# EAGLE schematic final version (1) (EAGLE 8.2.2)
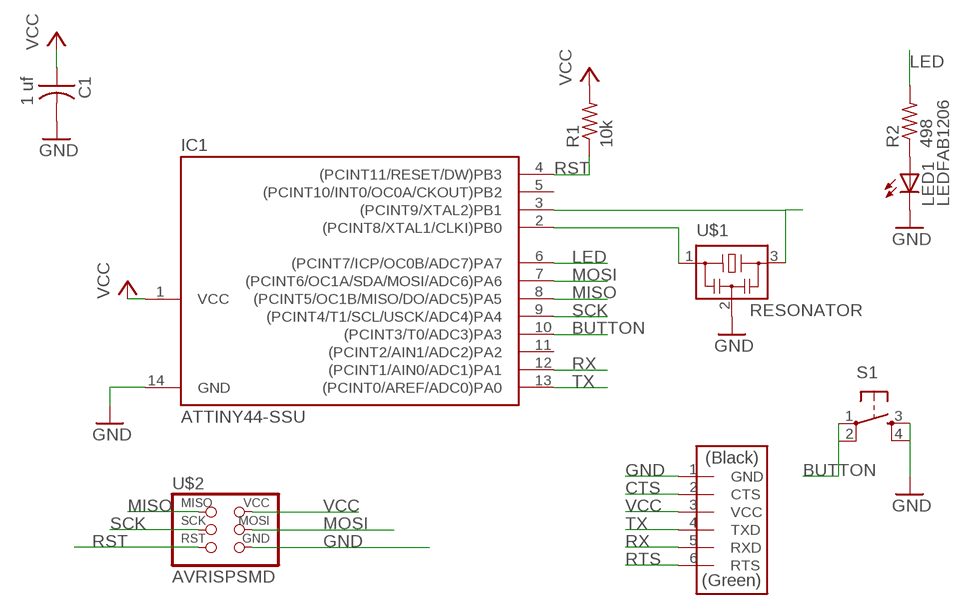
[diagram p0: schematic, sheet 1]

## Parts
C1  1 uf  CAP-US1206FAB  [C1206FAB]
IC1  ATTINY44-SSU  [SOIC14]
LED1  LEDFAB1206  [LED1206FAB]
R1  10k  RES-US1206FAB  [R1206FAB]
R2  498  RES-US1206FAB  [R1206FAB]
S1  6MM_SWITCH6MM_SWITCH  [6MM_SWITCH]
U$1  RESONATOR  [EFOBM]
U$2  AVRISPSMD  [2X03SMD]
U$3  FTDI-SMD-HEADER  [1X06SMD]

## Nets
BUTTON: IC1.10((PCINT3/T0/ADC3)PA3) S1.1(P)
CTS: U$3.2(CTS)
GND: C1.2 IC1.14(GND) LED1.2(C) S1.3(S) U$1.2 U$2.6(GND) U$3.1(GND)
LED: IC1.6((PCINT7/ICP/OC0B/ADC7)PA7) R2.2
MISO: IC1.8((PCINT5/OC1B/MISO/DO/ADC5)PA5) U$2.1(MISO)
MOSI: IC1.7((PCINT6/OC1A/SDA/MOSI/ADC6)PA6) U$2.4(MOSI)
N$1: IC1.2((PCINT8/XTAL1/CLKI)PB0) U$1.1
N$2: LED1.1(A) R2.1
N$4: IC1.3((PCINT9/XTAL2)PB1) U$1.3
RST: IC1.4((PCINT11/RESET/DW)PB3) R1.1 U$2.5(RST)
RTS: U$3.6(RTS)
RX: IC1.12((PCINT1/AIN0/ADC1)PA1) U$3.5(RXD)
SCK: IC1.9((PCINT4/T1/SCL/USCK/ADC4)PA4) U$2.3(SCK)
TX: IC1.13((PCINT0/AREF/ADC0)PA0) U$3.4(TXD)
VCC: C1.1 IC1.1(VCC) R1.2 U$2.2(VCC) U$3.3(VCC)
Unconnected: IC1.5((PCINT10/INT0/OC0A/CKOUT)PB2) IC1.11((PCINT2/AIN1/ADC2)PA2) S1.2(P1) S1.4(S1)

## Library data of the parts
C1 = fab:CAP-US
IC1 = fab:ATTINY44
LED1 = fab:LED: LED
R1 R2 = fab:RES-US: Resistor (US Symbol) Variants with postfix FAB are widened to allow the routing of internal traces
S1 = fab:6MM_SWITCH: OMRON SWITCH
U$1 = fab:RESONATOR
U$2 = fab:AVRISP
U$3 = fab:FTDI-SMD-HEADER